# EAGLE design adc_guarded_newinput_nobnc (EAGLE 5.07)
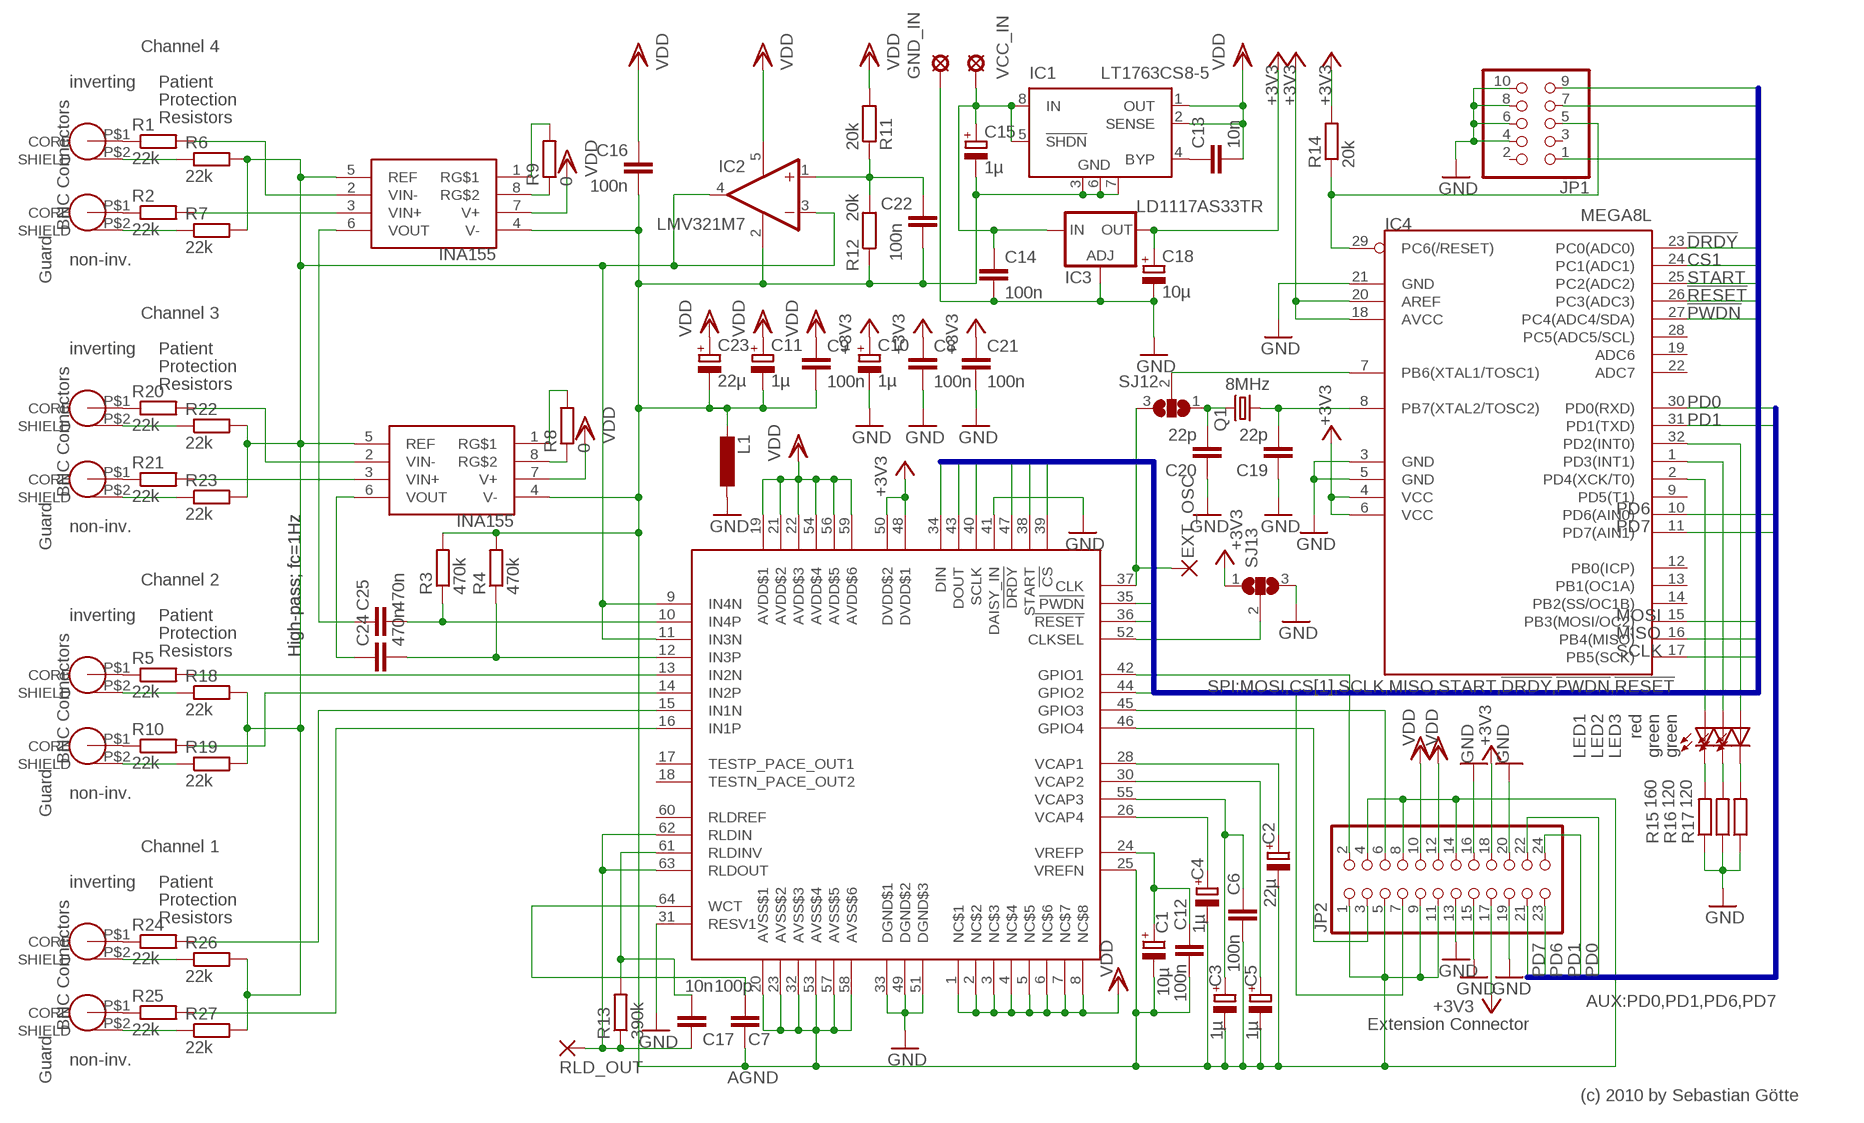
[diagram p0: schematic, sheet 1]

## Parts
C1  10µ  CPOL-EUSMCC  [SMC_C]
C2  22µ  CPOL-EUSMCD  [SMC_D]
C3  1µ  CPOL-EUSMCA  [SMC_A]
C4  1µ  CPOL-EUSMCA  [SMC_A]
C5  1µ  CPOL-EUSMCA  [SMC_A]
C6  100n  C-EUC1206  [C1206]
C7  100p  C-EUC1206  [C1206]
C8  100n  C-EUC1206  [C1206]
C9  100n  C-EUC1206  [C1206]
C10  1µ  CPOL-EUSMCA  [SMC_A]
C11  1µ  CPOL-EUSMCA  [SMC_A]
C12  100n  C-EUC1206  [C1206]
C13  10n  C-EUC1206  [C1206]
C14  100n  C-EUC1206  [C1206]
C15  1µ  CPOL-EUSMCA  [SMC_A]
C16  100n  C-EUC1206  [C1206]
C17  10n  C-EUC1206  [C1206]
C18  10µ  CPOL-EUSMCC  [SMC_C]
C19  22p  C-EUC1206  [C1206]
C20  22p  C-EUC1206  [C1206]
C21  100n  C-EUC1206  [C1206]
C22  100n  C-EUC1206  [C1206]
C23  22µ  CPOL-EUSMCD  [SMC_D]
C24  470n  C-EUC1206  [C1206]
C25  470n  C-EUC1206  [C1206]
EXT_OSC  1,6/0,8  [1,6/0,8]
GND_IN  MCS10B  [MCS10B]
IC1  LT1763CS8-5  LT1763CS8-3.3  [SOIC8]
IC2  LMV321M7  [SC70-5L]
IC3  LD1117AS33TR  LD117AS33TR  [SOT223]
IC4  MEGA8L  MEGA8-AI  [TQFP32-08]
JP1  PINHD-2X5  [2X05]
JP2  PINHD-2X12  [2X12]
L1  L-EUPIS2816  [PIS2816]
LED1  red  LEDCHIPLED_1206  [CHIPLED_1206]
LED2  green  LEDCHIPLED_1206  [CHIPLED_1206]
LED3  green  LEDCHIPLED_1206  [CHIPLED_1206]
Q1  8MHz  CRYSTALHC49UP  [HC49UP]
R1  22k  R-EU_R1206  [R1206]
R2  22k  R-EU_R1206  [R1206]
R3  470k  R-EU_R1206  [R1206]
R4  470k  R-EU_R1206  [R1206]
R5  22k  R-EU_R1206  [R1206]
R6  22k  R-EU_R1206  [R1206]
R7  22k  R-EU_R1206  [R1206]
R8  0  R-EU_R1206  [R1206]
R9  0  R-EU_R1206  [R1206]
R10  22k  R-EU_R1206  [R1206]
R11  20k  R-EU_R1206  [R1206]
R12  20k  R-EU_R1206  [R1206]
R13  390k  R-EU_R1206  [R1206]
R14  20k  R-EU_R1206  [R1206]
R15  160  R-EU_R1206  [R1206]
R16  120  R-EU_R1206  [R1206]
R17  120  R-EU_R1206  [R1206]
R18  22k  R-EU_R1206  [R1206]
R19  22k  R-EU_R1206  [R1206]
R20  22k  R-EU_R1206  [R1206]
R21  22k  R-EU_R1206  [R1206]
R22  22k  R-EU_R1206  [R1206]
R23  22k  R-EU_R1206  [R1206]
R24  22k  R-EU_R1206  [R1206]
R25  22k  R-EU_R1206  [R1206]
R26  22k  R-EU_R1206  [R1206]
R27  22k  R-EU_R1206  [R1206]
RLD_OUT  2,54/1,0  [2,54/1,0]
SJ12  SJ2W  [SJ_2]
SJ13  SJ2W  [SJ_2]
U$1  ADS1194  [TQFP-64]
U$2  INA155  [SO-08]
U$3  INA155  [SO-08]
U$4  RG174_THTTHROUGH-HOLE  [RG174_THT]
U$5  RG174_THTTHROUGH-HOLE  [RG174_THT]
U$6  RG174_THTTHROUGH-HOLE  [RG174_THT]
U$7  RG174_THTTHROUGH-HOLE  [RG174_THT]
U$8  RG174_THTTHROUGH-HOLE  [RG174_THT]
U$9  RG174_THTTHROUGH-HOLE  [RG174_THT]
U$10  RG174_THTTHROUGH-HOLE  [RG174_THT]
U$11  RG174_THTTHROUGH-HOLE  [RG174_THT]
VCC_IN  MCS10B  [MCS10B]

## Nets
!DRDY: IC4.23(PC0(ADC0)) U$1.47(!DRDY)
!PWDN: IC4.27(PC4(ADC4/SDA)) U$1.35(!PWDN)
!RESET: IC4.26(PC3(ADC3)) U$1.36(!RESET)
+3V3: C8.1 C10.+ C18.+ C21.1 IC3.4(OUT) IC4.4(VCC) IC4.6(VCC) IC4.18(AVCC) IC4.20(AREF) JP2.17 JP2.18 R14.2 SJ13.1 U$1.48(DVDD$1) U$1.50(DVDD$2)
ADS1194_GPIO1: JP2.2 U$1.42(GPIO1)
ADS1194_GPIO2: JP2.7 U$1.44(GPIO2)
ADS1194_GPIO3: JP2.6 U$1.45(GPIO3)
ADS1194_GPIO4: JP2.3 U$1.46(GPIO4)
AGND: C1.- C2.- C3.- C4.- C5.- C6.2 C7.1 C9.2 C11.- C12.2 C15.- C16.2 C22.2 C23.- IC1.3(GND) IC1.6(GND) IC1.7(GND) IC2.2(V-) JP2.1 JP2.4 JP2.5 JP2.8 JP2.9 JP2.11 JP2.14 L1.2 R3.2 R4.2 R12.1 U$1.20(AVSS$1) U$1.23(AVSS$2) U$1.25(VREFN) U$1.32(AVSS$3) U$1.53(AVSS$4) U$1.57(AVSS$5) U$1.58(AVSS$6) U$2.4(V-) U$3.4(V-)
CLK: EXT_OSC.1(P) SJ12.3 U$1.37(CLK)
CLKSEL: SJ13.2 U$1.52(CLKSEL)
CS1: IC4.24(PC1(ADC1)) U$1.39(!CS)
GND: C8.2 C10.- C14.2 C18.- C19.1 C20.1 C21.2 GND_IN.MP IC3.1(ADJ) IC4.3(GND) IC4.5(GND) IC4.21(GND) JP1.4 JP1.6 JP1.8 JP1.10 JP2.13 JP2.15 JP2.16 JP2.19 JP2.20 L1.1 R15.1 R16.1 R17.1 SJ13.3 U$1.31(RESV1) U$1.33(DGND$1) U$1.41(DAISY_IN) U$1.49(DGND$2) U$1.51(DGND$3)
MISO: IC4.16(PB4(MISO)) JP1.9 U$1.43(DOUT)
MOSI: IC4.15(PB3(MOSI/OC2)) JP1.1 U$1.34(DIN)
N$1: C2.+ U$1.28(VCAP1)
N$2: C4.+ U$1.26(VCAP4)
N$3: C7.2 U$1.64(WCT)
N$4: C5.+ U$1.30(VCAP2)
N$5: C3.+ C6.1 U$1.55(VCAP3)
N$6: C1.+ C12.1 U$1.24(VREFP)
N$7: R9.1 U$2.8(RG$2)
N$9: C25.2 R3.1 U$1.10(IN4P)
N$11: R5.2 U$1.13(IN2N)
N$12: R2.2 U$2.3(VIN+)
N$13: R1.2 U$2.2(VIN-)
N$14: R1.1 U$4.P$1(CORE)
N$15: R2.1 U$5.P$1(CORE)
N$16: C13.1 IC1.4(BYP)
N$17: R20.1 U$6.P$1(CORE)
N$18: R21.1 U$7.P$1(CORE)
N$19: R9.2 U$2.1(RG$1)
N$20: C25.1 U$2.6(VOUT)
N$21: R19.1 U$10.P$2(SHIELD)
N$22: R18.1 U$11.P$2(SHIELD)
N$23: R5.1 U$11.P$1(CORE)
N$24: R10.2 U$1.14(IN2P)
N$25: R8.2 U$3.1(RG$1)
N$26: C24.1 U$3.6(VOUT)
N$27: R10.1 U$10.P$1(CORE)
N$28: R20.2 U$3.2(VIN-)
N$29: R21.2 U$3.3(VIN+)
N$30: R7.1 U$5.P$2(SHIELD)
N$31: R6.1 U$4.P$2(SHIELD)
N$32: C24.2 R4.1 U$1.12(IN3P)
N$33: R8.1 U$3.8(RG$2)
N$34: C17.2 R13.2 U$1.61(RLDINV)
N$35: C20.2 Q1.2 SJ12.1
N$36: R24.2 U$1.15(IN1N)
N$37: R25.2 U$1.16(IN1P)
N$38: C19.2 IC4.8(PB7(XTAL2/TOSC2)) Q1.1
N$40: IC4.7(PB6(XTAL1/TOSC1)) SJ12.2
N$41: IC4.32(PD2(INT0)) LED3.A
N$42: IC4.1(PD3(INT1)) LED2.A
N$43: IC4.2(PD4(XCK/T0)) LED1.A
N$44: LED1.C R15.2
N$45: LED2.C R16.2
N$46: LED3.C R17.2
N$47: R24.1 U$9.P$1(CORE)
N$48: IC2.3(-IN) IC2.4(OUT) R6.2 R7.2 R18.2 R19.2 R22.2 R23.2 R26.2 R27.2 U$1.9(IN4N) U$1.11(IN3N) U$2.5(REF) U$3.5(REF)
N$49: R25.1 U$8.P$1(CORE)
N$58: R23.1 U$7.P$2(SHIELD)
N$59: R22.1 U$6.P$2(SHIELD)
N$65: R27.1 U$8.P$2(SHIELD)
N$66: R26.1 U$9.P$2(SHIELD)
PD0: IC4.30(PD0(RXD)) JP2.22
PD1: IC4.31(PD1(TXD)) JP2.24
PD6: IC4.10(PD6(AIN0)) JP2.23
PD7: IC4.11(PD7(AIN1)) JP2.21
REF_NODE: C22.1 IC2.1(+IN) R11.1 R12.2
RLD_OUT: C17.1 R13.1 RLD_OUT.1(P) U$1.62(RLDIN) U$1.63(RLDOUT)
SCLK: IC4.17(PB5(SCK)) JP1.7 U$1.40(SCLK)
START: IC4.25(PC2(ADC2)) U$1.38(START)
UCRESET: IC4.29(PC6(/RESET)) JP1.5 R14.1
VCC_IN: C14.1 C15.+ IC1.5(!SHDN) IC1.8(IN) IC3.3(IN) VCC_IN.MP
VDD: C9.1 C11.+ C13.2 C16.1 C23.+ IC1.1(OUT) IC1.2(SENSE) IC2.5(V+) JP2.10 JP2.12 R11.2 U$1.1(NC$1) U$1.2(NC$2) U$1.3(NC$3) U$1.4(NC$4) U$1.5(NC$5) U$1.6(NC$6) U$1.7(NC$7) U$1.8(NC$8) U$1.19(AVDD$1) U$1.21(AVDD$2) U$1.22(AVDD$3) U$1.54(AVDD$4) U$1.56(AVDD$5) U$1.59(AVDD$6) U$2.7(V+) U$3.7(V+)
Unconnected: IC4.9(PD5(T1)) IC4.12(PB0(ICP)) IC4.13(PB1(OC1A)) IC4.14(PB2(SS/OC1B)) IC4.19(ADC6) IC4.22(ADC7) IC4.28(PC5(ADC5/SCL)) JP1.2 JP1.3 U$1.17(TESTP_PACE_OUT1) U$1.18(TESTN_PACE_OUT2) U$1.60(RLDREF)

## Buses
SPI:MOSI,CS[1],SCLK,MISO,START,!DRDY,!PWDN,!RESET
AUX:PD0,PD1,PD6,PD7

## Notes on the sheet
- Channel 4
- inverting | Patient
- Protection
- Resistors
- BNC Connectors
- INA155
- non-inv.
- Guard
- Channel 3
- inverting | Patient
- Protection
- Resistors
- BNC Connectors
- INA155
- non-inv.
- Guard
- Channel 2
- inverting | Patient
- Protection
- Resistors | High-pass; fc=1Hz | High-pass; fc=1Hz
- BNC Connectors
- non-inv.
- Guard
- Channel 1
- inverting | Patient
- Protection
- Resistors
- BNC Connectors | Extension Connector
- non-inv.
- Guard | AGND
- (c) 2010 by Sebastian Götte

## Library data of the parts
C1-C5 C10 C11 C15 C18 C23 = rcl:CPOL-EU: POLARIZED CAPACITOR, European symbol
C6-C9 C12-C14 C16 C17 C19-C22 C24 C25 = rcl:C-EU: CAPACITOR, European symbol
EXT_OSC = wirepad:1,6/0,8: THROUGH-HOLE PAD
GND_IN VCC_IN = solpad:MCS10B: SOLDER PAD MC S1, distributor Buerklin, 15F505
IC1 = linear-technology:LT1763CS8: 500mA, Low Noise, LDO Micropower Regulators Source: http://cds.linear.com/docs/Datasheet/1763ff.pdf
IC2 = linear:LMV321?*: General Purpose, Low Voltage, Rail-to-Rail Output Operational Amplifiers Source: http://www.national.com/mpf/LM/LMV321.html http://www.national.com/dt/lmv_qual.pdf
IC3 = v-reg:LD117A?*: Low drop fixed and adjustable positive voltage regulators 1 A Source: http://www.st.com/stonline/products/literature/ds/7194/ld1117axx.pdf
IC4 = atmel:MEGA8: MICROCONTROLLER 8 Kbytes FLASH, 1 kbytes SRAM, 512 bytes EEPROM, USART, 6-channel 10 bit ADC, 2-channel 8 bit ADC Pin compatible with Atmega48, ATMega88, ATMega168 Source: avr.lbr
JP1 = pinhead:PINHD-2X5: PIN HEADER
JP2 = pinhead:PINHD-2X12: PIN HEADER
L1 = rcl:L-EU: INDUCTOR, European symbol
LED1-LED3 = led:LED: LED OSRAM: - CHIPLED LG R971, LG N971, LY N971, LG Q971, LY Q971, LO R971, LY R971 LH N974, LH R974 LS Q976, LO Q976, LY Q976 LO Q996 - Hyper CHIPLED LW Q18S LB Q993, LB Q99A, LB R99A - SideLED LS A670, LO A670, LY A670, LG A670, LP A670 LB A673, LV A673, LT A673, LW A673 LH A674 LY A675 LS A676, LA A676, LO A676, LY A676, LW A676 LS A679, LY A679, LG A679 - Hyper Micro SIDELED® LS Y876, LA Y876, LO Y876, LY Y876 LT Y87S - SmartLED LW L88C, LW L88S LB L89C, LB L89S, LG L890 LS L89K, LO L89K, LY L89K LS L896, LA L896, LO L896, LY L896 - TOPLED LS T670, LO T670, LY T670, LG T670, LP T670 LSG T670, LSP T670, LSY T670, LOP T670, LYG T670 LG T671, LOG T671, LSG T671 LB T673, LV T673, LT T673, LW T673 LH T674 LS T676, LA T676, LO T676, LY T676, LB T676, LH T676, LSB T676, LW T676 LB T67C, LV T67C, LT T67C, LS T67K, LO T67K, LY T67K, LW E67C LS E67B, LA E67B, LO E67B, LY E67B, LB E67C, LV E67C, LT E67C LW T67C LS T679, LY T679, LG T679 LS T770, LO T770, LY T770, LG T770, LP T770 LB T773, LV T773, LT T773, LW T773 LH T774 LS E675, LA E675, LY E675, LS T675 LS T776, LA T776, LO T776, LY T776, LB T776 LHGB T686 LT T68C, LB T68C - Hyper Mini TOPLED® LB M676 - Mini TOPLED Santana® LG M470 LS M47K, LO M47K, LY M47K Source: http://www.osram.convergy.de LUXEON: - LUMILED® LXK2-PW12-R00, LXK2-PW12-S00, LXK2-PW14-U00, LXK2-PW14-V00 LXK2-PM12-R00, LXK2-PM12-S00, LXK2-PM14-U00 LXK2-PE12-Q00, LXK2-PE12-R00, LXK2-PE12-S00, LXK2-PE14-T00, LXK2-PE14-U00 LXK2-PB12-K00, LXK2-PB12-L00, LXK2-PB12-M00, LXK2-PB14-N00, LXK2-PB14-P00, LXK2-PB14-Q00 LXK2-PR12-L00, LXK2-PR12-M00, LXK2-PR14-Q00, LXK2-PR14-R00 LXK2-PD12-Q00, LXK2-PD12-R00, LXK2-PD12-S00 LXK2-PH12-R00, LXK2-PH12-S00 LXK2-PL12-P00, LXK2-PL12-Q00, LXK2-PL12-R00 Source: www.luxeon.com KINGBRIGHT: KA-3528ASYC Source: www.kingbright.com
Q1 = crystal:CRYSTAL: CRYSTAL
R1-R27 = rcl:R-EU_: RESISTOR, European symbol
RLD_OUT = wirepad:2,54/1,0: THROUGH-HOLE PAD
SJ12 SJ13 = jumper:SJ2W: SMD solder JUMPER
U$1 = mytexas:ADS1194: Low-Power, 8-Channel, 16-Bit Analog Front-End for Biopotential Measurements for ECG/EEG applications
U$2 U$3 = mytexas:INA155: Single-Supply, Rail-to-Rail Output, CMOS INSTRUMENTATION AMPLIFIER
U$4-U$11 = myparts:RG174_THT

## Board
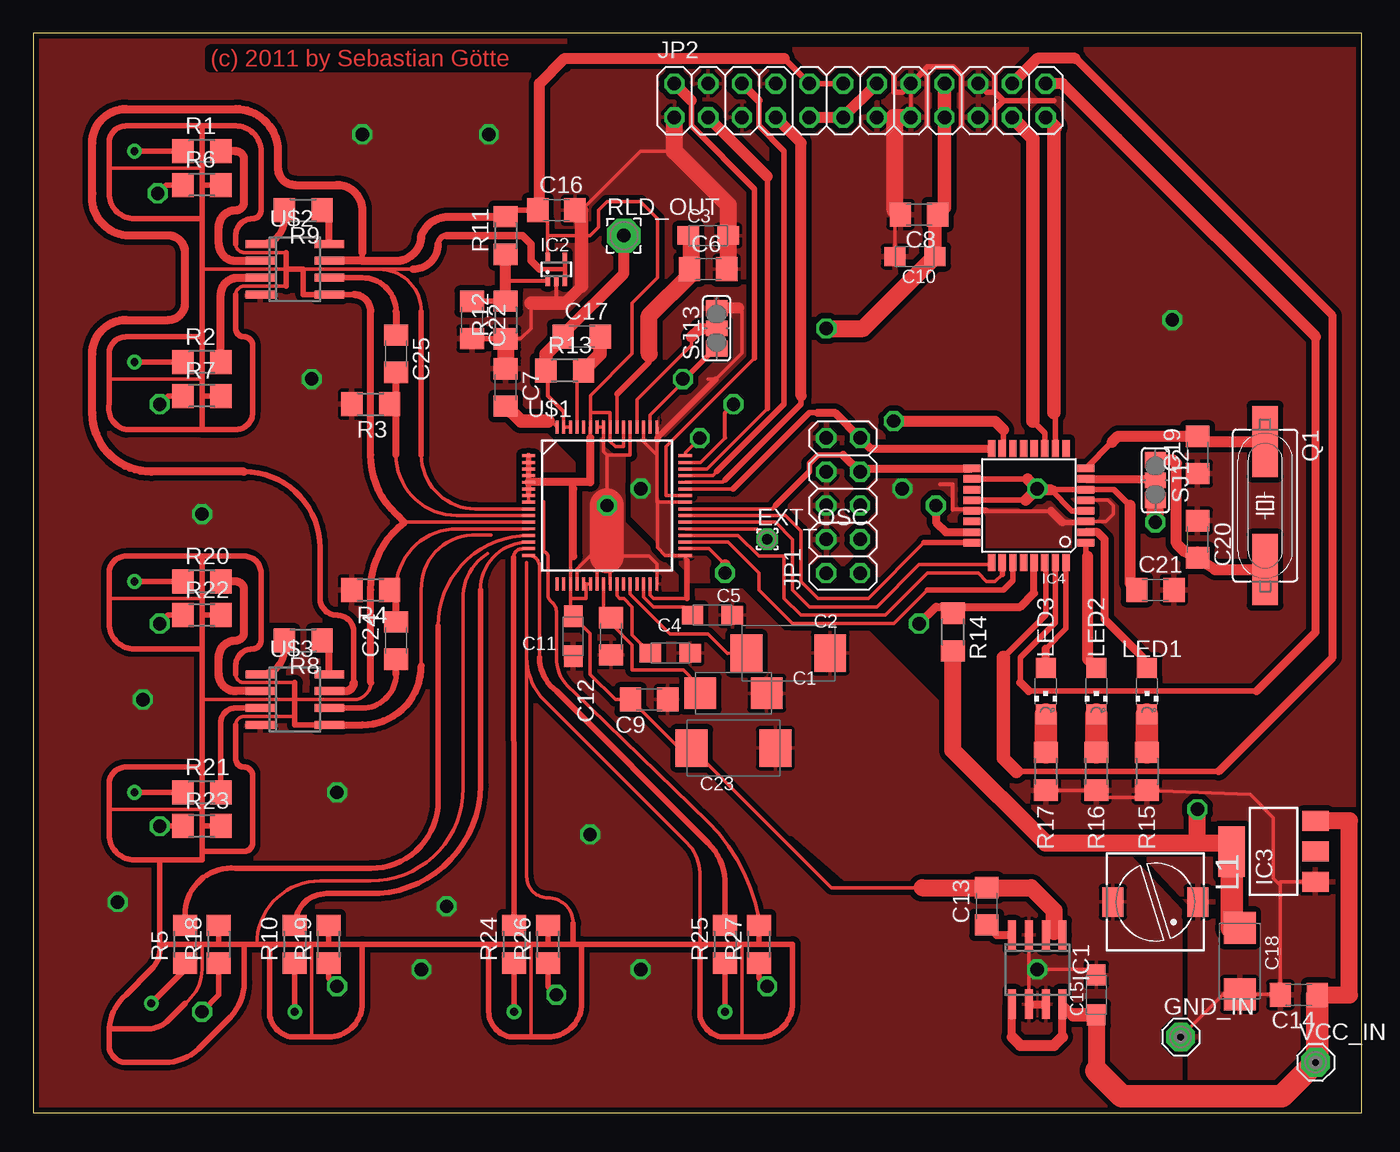
[diagram p1: board, top side]
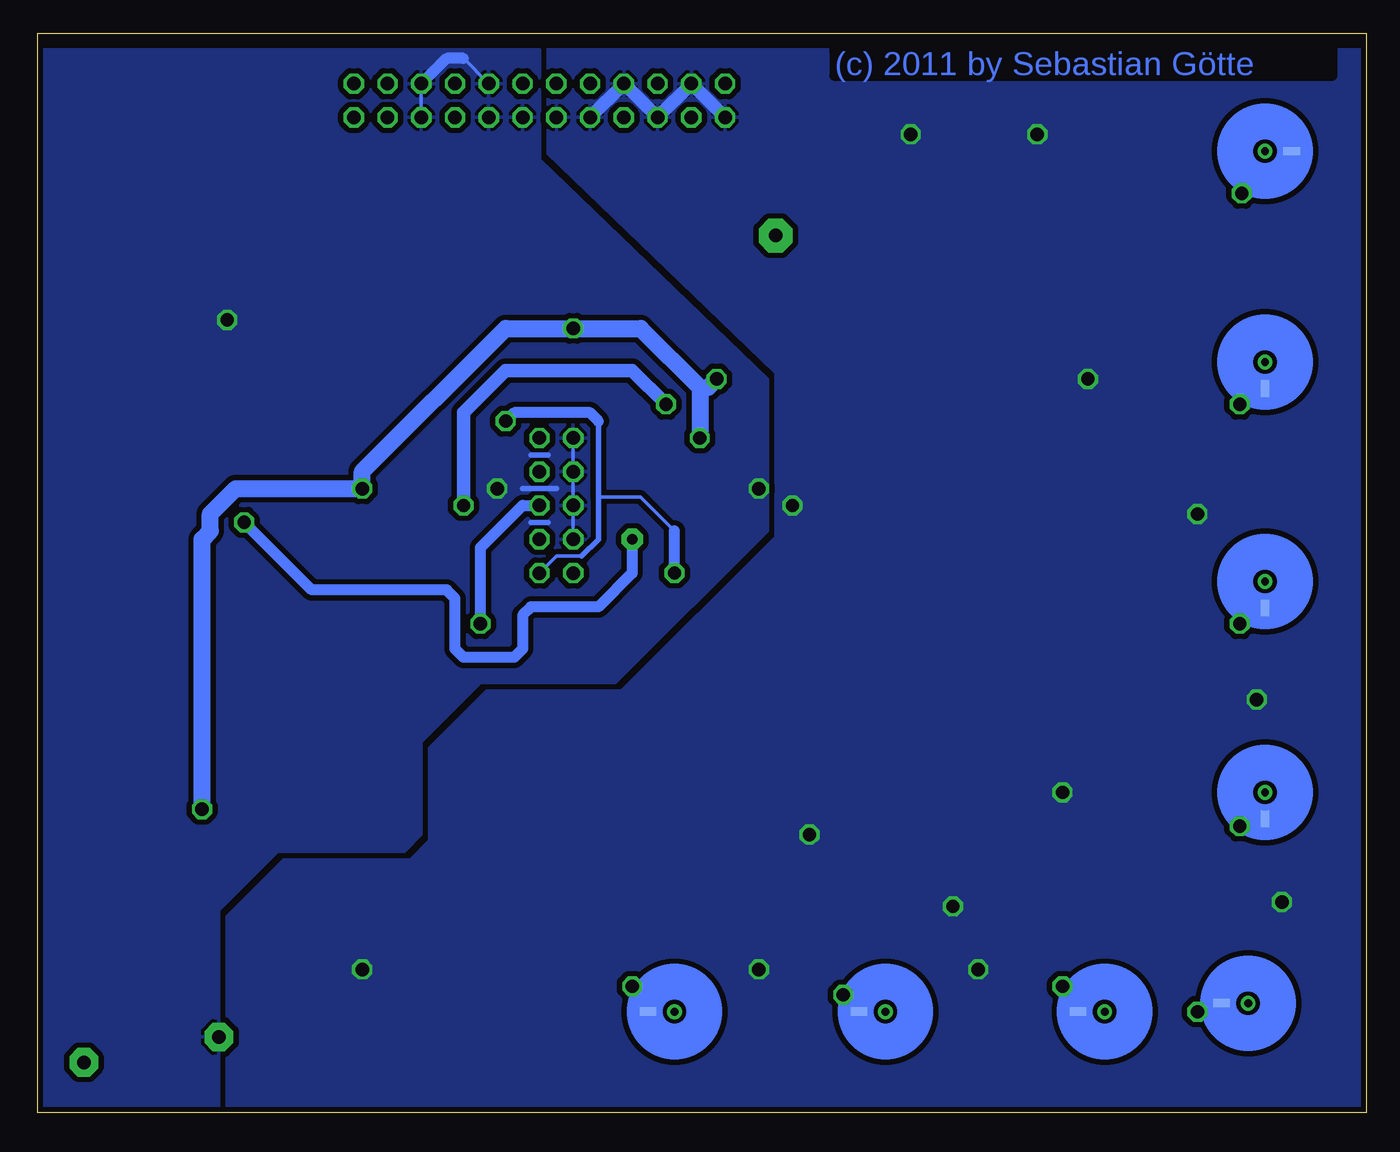
[diagram p2: board, bottom side, seen from below]

Size 100 x 81.27 mm. Coordinates in mm from the lower left corner, seen from the top.
Outline: 0,0 100,0 100,81.27 0,81.27 0,0
Copper layers (1*16): Top 0.035mm / dielectric 1.5mm / Bottom 0.035mm
Design rules "Fusion_eagle_rule_v1.1": minimum track width 6mil, minimum drill 12mil, track to track 6mil, track to pad 6mil, pad to pad 6mil, via to via 6mil, smd to smd 0mil, copper to edge 10mil, drill to drill 10mil, minimum pad ring 10mil, minimum via ring 6mil, stop-mask expansion 2mil, vias tented up to drill 100mil, thermal gap 10mil

### Footprints (pad centres in the part's own frame; a part is rotated, then mirrored left to right if it is on the bottom)
SMC_C = smd 2.4 x 2.4: + -2.5,0; - 2.5,0
SMC_D = smd 2.4 x 2.8: + -3.15,0; - 3.15,0
SMC_A = smd 1.6 x 1.4: + -1.5,0; - 1.5,0
C1206 = smd 1.6 x 1.8: 1 -1.4,0; 2 1.4,0
1,6/0,8 = drill 0.813 pad 1.6 octagon: 1 0,0
MCS10B = drill 1.016 pad 2.159 octagon: MP 0,0
SOIC8 = smd 0.6 x 2.2: 1 -1.905,-2.6; 2 -0.635,-2.6; 3 0.635,-2.6; 4 1.905,-2.6; 5 1.905,2.6; 6 0.635,2.6; 7 -0.635,2.6; 8 -1.905,2.6
SC70-5L = smd 0.35 x 0.8: 1 -0.65,-0.85; 2 0,-0.85; 3 0.65,-0.85; 4 0.65,0.85; 5 -0.65,0.85
SOT223 = smd 1.5 x 2: 1 -2.3,-3.15; 2 0,-3.15; 3 2.3,-3.15 | smd 3.8 x 2: 4 0,3.15
TQFP32-08 = smd 1.27 x 0.559: 1 -4.293,2.8; 2 -4.293,2; 3 -4.293,1.2; 4 -4.293,0.4; 5 -4.293,-0.4; 6 -4.293,-1.2; 7 -4.293,-2; 8 -4.293,-2.8; 17 4.293,-2.8; 18 4.293,-2; 19 4.293,-1.2; 20 4.293,-0.4; 21 4.293,0.4; 22 4.293,1.2; 23 4.293,2; 24 4.293,2.8 | smd 0.559 x 1.27: 9 -2.8,-4.293; 10 -2,-4.293; 11 -1.2,-4.293; 12 -0.4,-4.293; 13 0.4,-4.293; 14 1.2,-4.293; 15 2,-4.293; 16 2.8,-4.293; 25 2.8,4.293; 26 2,4.293; 27 1.2,4.293; 28 0.4,4.293; 29 -0.4,4.293; 30 -1.2,4.293; 31 -2,4.293; 32 -2.8,4.293
2X05 = drill 1.016 octagon: 1 -5.08,-1.27; 2 -5.08,1.27; 3 -2.54,-1.27; 4 -2.54,1.27; 5 0,-1.27; 6 0,1.27; 7 2.54,-1.27; 8 2.54,1.27; 9 5.08,-1.27; 10 5.08,1.27
2X12 = drill 1.016 octagon: 1 -13.97,-1.27; 2 -13.97,1.27; 3 -11.43,-1.27; 4 -11.43,1.27; 5 -8.89,-1.27; 6 -8.89,1.27; 7 -6.35,-1.27; 8 -6.35,1.27; 9 -3.81,-1.27; 10 -3.81,1.27; 11 -1.27,-1.27; 12 -1.27,1.27; 13 1.27,-1.27; 14 1.27,1.27; 15 3.81,-1.27; 16 3.81,1.27; 17 6.35,-1.27; 18 6.35,1.27; 19 8.89,-1.27; 20 8.89,1.27; 21 11.43,-1.27; 22 11.43,1.27; 23 13.97,-1.27; 24 13.97,1.27
PIS2816 = smd 2.2 x 1.6: 1 0,3.2; 2 0,-3.2
CHIPLED_1206 = smd 1.5 x 1.5: A 0,-1.75; C 0,1.75
HC49UP = smd 5.334 x 1.93: 1 -4.826,0; 2 4.826,0
R1206 = smd 1.6 x 1.803: 1 -1.422,0; 2 1.422,0
2,54/1,0 = drill 1.016 pad 2.54 octagon: 1 0,0
SJ_2 = smd 1.168 x 1.6: 1 -1.524,0; 2 0,0; 3 1.524,0
TQFP-64 = smd 1 x 0.22: 1 -5.9,3.75; 2 -5.9,3.25; 3 -5.9,2.75; 4 -5.9,2.25; 5 -5.9,1.75; 6 -5.9,1.25; 7 -5.9,0.75; 8 -5.9,0.25; 9 -5.9,-0.25; 10 -5.9,-0.75; 11 -5.9,-1.25; 12 -5.9,-1.75; 13 -5.9,-2.25; 14 -5.9,-2.75; 15 -5.9,-3.25; 16 -5.9,-3.75; 33 5.9,-3.75; 34 5.9,-3.25; 35 5.9,-2.75; 36 5.9,-2.25; 37 5.9,-1.75; 38 5.9,-1.25; 39 5.9,-0.75; 40 5.9,-0.25; 41 5.9,0.25; 42 5.9,0.75; 43 5.9,1.25; 44 5.9,1.75; 45 5.9,2.25; 46 5.9,2.75; 47 5.9,3.25; 48 5.9,3.75 | smd 0.22 x 1: 17 -3.75,-5.9; 18 -3.25,-5.9; 19 -2.75,-5.9; 20 -2.25,-5.9; 21 -1.75,-5.9; 22 -1.25,-5.9; 23 -0.75,-5.9; 24 -0.25,-5.9; 25 0.25,-5.9; 26 0.75,-5.9; 27 1.25,-5.9; 28 1.75,-5.9; 29 2.25,-5.9; 30 2.75,-5.9; 31 3.25,-5.9; 32 3.75,-5.9; 49 3.75,5.9; 50 3.25,5.9; 51 2.75,5.9; 52 2.25,5.9; 53 1.75,5.9; 54 1.25,5.9; 55 0.75,5.9; 56 0.25,5.9; 57 -0.25,5.9; 58 -0.75,5.9; 59 -1.25,5.9; 60 -1.75,5.9; 61 -2.25,5.9; 62 -2.75,5.9; 63 -3.25,5.9; 64 -3.75,5.9
SO-08 = smd 0.6 x 2.2: 1 -1.905,-2.6; 2 -0.635,-2.6; 3 0.635,-2.6; 4 1.905,-2.6; 5 1.905,2.6; 6 0.635,2.6; 7 -0.635,2.6; 8 -1.905,2.6
RG174_THT = drill 0.6 round: P$1 0,0 | smd 1.27 x 0.635: P$2 2,0

### Placement (x,y rotation side)
C1  52.71,31.59 0 top
C2  56.83,34.61 0 top
C3  50.8,66.04 0 top
C4  47.94,34.61 0 top
C5  51.12,37.47 0 top
C6  50.8,63.5 0 top
C7  35.56,54.61 270 top
C8  66.67,67.63 180 top
C9  46.35,31.11 0 top
C10  66.36,64.45 180 top
C11  40.64,35.88 270 top
C12  43.5,35.88 270 top
C13  71.75,15.56 90 top
C14  95.25,8.89 180 top
C15  80.01,8.89 90 top
C16  39.37,67.94 0 top
C17  41.27,58.42 0 top
C18  90.81,11.43 270 top
C19  87.63,49.53 90 top
C20  87.63,43.18 270 top
C21  84.45,39.37 0 top
C22  33.02,59.69 270 top
C23  52.7,27.46 0 top
C24  27.3,35.56 90 top
C25  27.3,57.15 270 top
EXT_OSC  55.24,43.18 0 top
GND_IN  86.36,5.71 0 top
IC1  75.56,10.79 180 top
IC2  39.37,63.5 0 top
IC3  93.34,19.68 90 top
IC4  74.93,45.72 180 top
JP1  60.96,45.72 90 top
JP2  62.23,76.2 0 top
L1  84.45,15.88 270 top
LED1  83.82,31.75 180 top
LED2  80.01,31.75 180 top
LED3  76.2,31.75 180 top
Q1  92.71,45.72 270 top
R1  12.7,72.39 0 top
R2  12.7,56.52 0 top
R3  25.4,53.34 180 top
R4  25.4,39.37 180 top
R5  11.43,12.7 90 top
R6  12.7,69.85 0 top
R7  12.7,53.98 0 top
R8  20.32,35.56 180 top
R9  20.32,67.94 180 top
R10  19.68,12.7 90 top
R11  35.56,66.04 90 top
R12  35.56,59.69 90 top
R13  40.01,55.88 0 top
R14  69.22,36.2 270 top
R15  83.82,25.72 90 top
R16  80.01,25.72 90 top
R17  76.2,25.72 90 top
R18  13.97,12.7 90 top
R19  22.23,12.7 90 top
R20  12.7,40.01 0 top
R21  12.7,24.13 0 top
R22  12.7,37.47 0 top
R23  12.7,21.59 0 top
R24  36.2,12.7 90 top
R25  52.07,12.7 90 top
R26  38.73,12.7 90 top
R27  54.61,12.7 90 top
RLD_OUT  44.45,66.04 0 top
SJ12  84.45,47.62 270 top
SJ13  51.44,59.05 90 top
U$1  43.18,45.72 0 top
U$2  19.68,63.5 270 top
U$3  19.68,31.11 270 top
U$4  7.62,72.39 0 bottom
U$5  7.62,56.52 270 bottom
U$6  7.62,40.01 270 bottom
U$7  7.62,24.13 270 bottom
U$8  52.07,7.62 180 bottom
U$9  36.2,7.62 180 bottom
U$10  19.68,7.62 180 bottom
U$11  8.89,8.26 180 bottom
VCC_IN  96.52,3.81 0 top

### Tracks (layer width: path | path; a pad name or v marks a point on that pad's centre or on a via)
!DRDY  (via drill 1)
  Top 0.254: U$1.47 50.24,48.97 52.07,50.8
  Top 0.305: 52.07,50.8 52.07,52.7 v52.7,53.34
  Top 0.61: v67.94,45.72 67.94,44.45 68.67,43.72 IC4.23
  Bottom 1.016: v52.7,53.34 55.24,55.88 64.77,55.88 67.94,52.7 v67.94,45.72
!PWDN
  Top 0.254: U$1.35 52.28,42.97 54.61,40.64 54.61,39.37 57.15,36.83 64.77,36.83 67.31,39.37
  Top 0.406: 67.31,39.37 73.03,39.37 73.73,40.08 IC4.27
!RESET
  Top 0.254: U$1.36 53.05,43.47 54.61,41.91 56.52,41.91 56.52,38.73 57.78,37.47 64.14,37.47 67.31,40.64 71.12,40.64 71.75,40.01 72.39,40.01 72.93,40.55
  Top 0.406: 72.93,40.55 IC4.26
+3V3  (via drill 1)
  Top 0.254: 67.86,67.41 C8.1 68.58,68.13 | v75.56,46.99 75.64,46.92 | 89.56,20.32 IC3.4 | U$1.50 46.43,52.53 SJ13.1 51.18,57.53 v48.9,55.24 | U$1.48 49.08,49.72 v50.16,50.8 | 82.55,39.88 C21.1
  Top 0.406: 76.83,46.92 IC4.6 81.35,46.92 82.55,45.72 | 78.44,45.32 IC4.4 78.19,45.32 76.59,46.92 | 74.83,47.72 IC4.18 | 74.69,46.12 IC4.20
  Top 0.61: 76.52,46.92 76.83,46.92
  Top 0.813: 75.64,46.92 76.52,46.92 76.59,46.92 | 74.83,47.72 v75.56,46.99 74.69,46.12 | 82.55,45.72 82.55,39.88
  Top 1.016: C10.+ 67.86,67.41 | 68.58,68.13 JP2.17 JP2.18
  Top 1.27: 87.63,20.32 76.2,20.32 69.22,27.3 R14.2 | 87.63,20.32 89.56,20.32 | v59.69,59.05 62.46,59.05 C10.+ | 87.63,20.32 v87.63,22.86
  Top 1.676: C18.+ 90.19,13.93 IC3.4
  Bottom 0.254: 50.16,54.61 49.53,54.61
  Bottom 1.27: v50.16,50.8 50.16,54.61 54.61,59.05 v59.69,59.05 64.77,59.05 75.56,48.26 v75.56,46.99 85.09,46.99 87,45.09 87,43.81 87.63,43.18 v87.63,22.86 | 49.53,54.61 v48.9,55.24
ADS1194_GPIO1
  Top 0.254: U$1.42 47.62,46.47 47.62,50.16 54.29,56.83
  Top 0.406: 49.53,76.2 49.53,74.3 54.29,69.53 54.29,56.83
  Top 0.813: 49.53,76.2 JP2.2
ADS1194_GPIO2
  Top 0.254: 52.07,47.62 51.91,47.47 U$1.44
  Top 0.406: 57.78,53.98 57.78,53.34 52.07,47.62
  Top 0.813: JP2.7 57.78,73.03 57.78,53.98
ADS1194_GPIO3
  Top 0.254: U$1.45 51.15,47.97 51.44,48.26
  Top 0.406: 51.44,48.26 56.52,53.34 56.52,72.39 54.61,74.3 54.61,76.2
  Top 0.61: 54.61,76.2 JP2.6
ADS1194_GPIO4
  Top 0.254: U$1.46 50.69,48.47 55.24,53.02
  Top 0.406: 55.24,53.02 55.24,70.48
  Top 0.813: 55.24,70.48 JP2.3
AGND  (via drill 1)
  Top 0.254: U$1.20 40.93,40.93 41.91,41.91 42.43,41.39 | U$1.23 42.43,41.39 | 42.43,41.39 42.95,41.91 43.18,41.91 43.43,41.66 U$1.25 43.43,41.52 43.81,41.91 46.35,41.91 46.93,41.34 U$1.32 | 43.18,49.53 42.93,49.78 U$1.57 U$1.58 | v43.18,45.72 43.18,49.53 | IC1.6 74.93,10.79 | 74.93,10.79 IC1.3 | C15.- 79.61,10.79 v75.56,10.79 74.93,10.79 | 48.26,72.39 45.72,72.39 41.27,67.94 | R12.1 36.68,58.27 37.47,59.05 37.47,60.96 | U$1.53 44.93,49.53 43.18,49.53
  Top 0.305: 39.37,60.96 IC2.2
  Top 0.406: R12.1 33.04,58.27 C22.2
  Top 0.61: IC1.6 IC1.7
  Top 0.813: 40.01,60.96 41.27,62.23 | JP2.9 JP2.11 JP2.14
  Top 1.016: 41.27,62.23 41.27,67.94 | 37.47,60.96 39.37,60.96 40.01,60.96
  Top 1.27: C6.2 52.3,64.05 C3.- 52.3,68.35 48.26,72.39 JP2.1 | R12.1 C7.1
  Top 2.54: 43.18,41.91 v43.18,45.72
  Bottom 1.016: JP2.1 JP2.4 JP2.5 JP2.8 JP2.9
  other vias: 20.95,55.24 41.91,20.95 31.11,15.56 22.86,24.13 34.29,73.66 24.77,73.66 12.7,45.09 8.26,31.11 6.35,15.88 29.21,10.79 45.72,10.79
  pour Top (isolate 0.406): 0,81.28 40.01,81.28 40.01,79.38 38.1,77.47 38.1,51.44 40.64,48.9 40.64,29.84 47.62,22.86 55.88,22.86 61.59,17.14 61.59,0 16.51,0 0,0 0,64.77
  pour Bottom (isolate 0.406, rank 2): 62.23,80.01 0,80.01 0,60.33 0,0 86.36,0 86.36,20.95 73.03,20.95 73.03,33.02 57.15,33.02 57.15,44.45 45.72,44.45 45.72,53.34 57.78,53.34 57.78,66.04 71.75,66.04 71.75,80.01
  pour Top (isolate 0.406, rank 2): 86.36,0 86.36,15.24 81.92,20 75.88,20 68.58,27.3 68.58,30.48 62.87,36.2 56.52,36.2 53.34,39.37 49.53,39.37 44.45,44.45 44.45,59.69 47.62,62.87 55.24,62.87 55.24,80.01 38.1,80.01 38.1,51.44 40.64,48.9 40.64,40.64 39.37,39.37 39.37,28.57 46.99,20.95 57.15,20.95 61.59,17.14 61.59,0
CLK  (via drill 1)
  Top 0.254: U$1.37 54.45,43.97 EXT_OSC.1
  Top 1.27: v84.45,44.45 SJ12.3
  Bottom 0.813: EXT_OSC.1 55.24,40.64 57.78,38.1 62.87,38.1 63.5,37.47 63.5,34.92 64.14,34.29 67.94,34.29 68.58,34.92 68.58,38.73 69.22,39.37 79.38,39.37 v84.45,44.45
CLKSEL
  Top 0.254: U$1.52 45.43,53.69 49.53,57.78 49.53,58.42
  Top 0.813: 49.53,58.42 50.16,59.05 SJ13.2
CS1
  Top 0.254: U$1.39 56.63,44.97 57.78,43.81 57.78,40.01 59.05,38.73 62.87,38.73 67.05,42.92
  Top 0.406: 67.05,42.92 IC4.24
GND  (via drill 1)
  Top 0.254: 79.15,44.45 IC4.3 80.72,44.52 81.28,45.09 81.28,45.72 80.88,46.12 IC4.5 | R17.1 R16.1 80.24,23.75 83.59,23.75 R15.1 | R15.1 83.5,23.98 | 64.77,74.93 JP2.13 | JP2.15 JP2.16 | 49.21,41.59 49.08,41.73 U$1.33 47.56,41.97 46.99,42.55 46.99,45.97 | GND_IN.MP 89.58,8.93 C18.- 93.81,8.93 C14.2 93.85,17.14 | IC3.1 93.85,17.39 93.85,17.14 | 46.93,49.53 46.93,45.97 46.99,45.97 | 46.93,49.53 46.93,50.8 U$1.49 | 46.99,45.97 U$1.41 | C10.- 64.86,66.76 65.41,67.31 65.41,67.5 C8.2 | 53.09,60.58 53.34,60.33 53.34,57.21 51.38,55.24 50.8,55.24 | U$1.51 45.93,50.53 46.93,49.53 | R15.1 91.59,23.98 93.34,22.23 93.34,17.65 93.85,17.14 | 71.75,45.4 70.72,45.4 IC4.21 | U$1.31 46.43,38.98 46.67,38.73 49.21,38.73
  Top 0.305: IC4.21 76.6,45.32 | 71.75,45.4 69.22,45.4 69.22,47.31 68.26,47.31
  Top 0.406: 77.47,44.45 79.15,44.45 | 46.93,50.8 51.38,55.24 | 64.77,78.11 64.77,76.83 65.41,76.83 JP2.16 66.99,78.42 | 72.39,76.83 72.39,78.11 | 72.39,74.3 72.39,75.56 73.03,76.2 | 73.03,76.2 76.83,76.2 | 72.39,76.83 73.03,76.2 | 72.39,76.83 71.75,76.83 JP2.20 | 69.85,74.3 69.85,78.11 69.22,78.74 67.31,78.74 66.99,78.42 | 67.31,74.3 67.31,78.11 66.99,78.42 | 49.21,38.73 49.21,41.59
  Top 0.61: 76.6,45.32 77.47,44.45
  Top 0.813: 64.86,74.84 64.77,74.93 | 64.86,67.94 65.17,67.63 | 53.09,60.58 SJ13.3
  Top 1.27: 64.77,74.93 JP2.15 | 64.86,67.94 64.86,74.84
  Bottom 0.254: JP1.10 JP1.8 JP1.6 JP1.4 | JP2.20 JP2.19 | JP2.16 67.94,79.38
  Bottom 0.406: 62.87,49.53 61.59,49.53 | 60.96,46.99 63.5,46.99 | 62.87,44.45 61.59,44.45
  Bottom 0.813: 67.94,79.38 69.22,79.38 JP2.20
  other vias: 65.41,46.99 45.72,46.99 85.72,59.69
  pour Top (isolate 0.406, rank 3): 100.33,80.01 38.73,80.01 38.73,0 100.33,0
  pour Bottom (isolate 0.406): 99.69,80.01 62.23,80.01 62.23,71.75 45.09,55.24 45.09,43.81 56.52,32.38 66.67,32.38 71.12,27.94 71.12,20.95 72.39,19.68 81.92,19.68 86.36,15.24 86.36,0 99.69,0
MISO
  Top 0.254: U$1.43 52.69,46.97
  Top 0.406: 59.05,52.7 58.42,52.7 52.69,46.97
  Top 0.61: 59.05,52.7 60.33,52.7 JP1.9 63.02,50.01 IC4.16
MOSI  (via drill 1)
  Top 0.254: 73.03,50.11 IC4.15 | U$1.34 50.88,42.47 52.07,41.27
  Top 0.406: 73.03,51.44 73.03,50.11
  Top 0.813: 73.03,51.44 72.39,52.07 v64.77,52.07 | 52.07,41.27 v52.07,40.64
  Bottom 0.254: 59.05,41.91 60.96,41.91 JP1.1 | 52.07,43.81 54.61,46.35 57.78,46.35
  Bottom 0.406: 59.05,41.91 57.78,43.18 57.78,46.35 57.78,52.07
  Bottom 0.813: 57.78,52.07 58.42,52.7 64.14,52.7 v64.77,52.07 | v52.07,40.64 52.07,43.81
N$1
  Top 0.254: U$1.28 44.93,39.05 47.94,36.04 50.8,36.04 52.25,34.58 C2.+
N$2
  Top 0.254: U$1.26 43.93,38.94 44.13,38.73 44.45,38.73 45.09,38.1 45.09,35.97 C4.+
N$3
  Top 0.254: 39.43,51.69 U$1.64 38.98,52.07 38.73,52.07
  Top 1.016: C7.2 36.7,52.07 38.73,52.07
N$4
  Top 0.254: U$1.30 45.93,38.84 46.67,38.1 48.98,38.1 C5.+
N$5
  Top 0.254: C6.1 49.53,63.5 | U$1.55 43.93,54.09
  Top 0.305: 49.53,65.81 C3.+
  Top 0.406: 43.93,54.09 46.35,56.52 46.35,57.15
  Top 1.27: C6.1 49.53,63.18 46.35,60.01 46.35,57.15 | 49.53,63.5 49.53,65.81
N$6
  Top 0.254: U$1.24 42.93,37.84 C12.1 43.5,36.83 45.09,35.24 45.09,33.34 48.94,33.34 49.85,32.38 C1.+
N$7
  Top 0.508: R9.1 arc-90 22.29,67.4 U$2.8
N$8
  Top 0.61: 40.64,41.91 40.64,46.99
N$9
  Top 0.254: U$1.10 31.86,44.97 arc-90 27.3,49.53 | R3.1 27.3,53.34 C25.2
  Top 0.508: 27.3,49.53 C25.2
N$11
  Top 0.254: 30.48,36.67 arc-90 U$1.13
  Top 0.406: 30.48,36.67 30.48,23.5 arc-90 25.4,18.41 15.24,18.41 arc90 11.43,15.24 R5.2
N$12
  Top 0.61: U$2.3 15.39,62.87 arc90 14.12,61.59 R2.2
N$13
  Top 0.61: R1.2 15.24,72.39 arc-90 15.88,71.75 15.88,68.58 arc-90 15.24,67.94 arc90 13.97,66.67 13.97,65.41 arc90 15.24,64.14 U$2.2
N$14
  Top 0.406: U$4.P$1 R1.1
N$15
  Top 0.406: U$5.P$1 R2.1
N$16
  Top 0.61: IC1.4 72.52,13.39 C13.1
N$17
  Top 0.406: U$6.P$1 R20.1
N$18
  Top 0.406: U$7.P$1 R21.1
N$19
  Top 0.508: U$2.1 arc90 18.9,67.22 R9.2
N$20
  Top 0.254: C25.1 27.3,58.42
  Top 0.406: U$2.6 24.77,62.87 arc-90 27.3,60.33
  Top 0.508: 27.3,60.33 C25.1
N$21  (via drill 1)
  Top 0.406: R19.1 22.23,10.16 v22.86,9.53
  Bottom 0.406: v22.86,9.53 22.86,8.79 U$10.P$2
N$22  (via drill 1)
  Top 0.406: R18.1 13.97,8.89 v12.7,7.62
  Bottom 0.406: v12.7,7.62 11.53,7.62 U$11.P$2
N$23
  Top 0.406: R5.1 11.43,10.79 U$11.P$1
N$24
  Top 0.254: U$1.14 37.26,42.97 arc90 33.66,39.37
  Top 0.406: R10.2 arc-90 22.07,16.51 26.04,16.51 arc90 33.66,25.4 33.66,39.37
N$25
  Top 0.508: U$3.1 arc90 18.9,34.83 R8.2
N$26
  Top 0.406: U$3.6 24.77,30.48 arc90 27.3,33.02
  Top 0.508: 27.3,33.02 C24.1
N$27
  Top 0.406: U$10.P$1 R10.1
N$28
  Top 0.61: R20.2 15.24,40.01 arc-90 15.88,39.37 15.88,36.2 arc-90 15.24,35.56 arc90 13.97,34.29 13.97,33.02 arc90 15.24,31.75 U$3.2
N$29
  Top 0.406: U$3.3 15.24,30.48 arc90 14.12,29.36 R21.2
N$30  (via drill 1)
  Top 0.406: R7.1 10.16,53.98 v9.53,53.34
  Bottom 0.406: v9.53,53.34 8.79,53.34 U$5.P$2
N$31  (via drill 1)
  Top 0.406: R6.1 10,69.85 v9.37,69.22
  Bottom 0.406: v9.37,69.22 9.11,69.22 U$4.P$2
N$32
  Top 0.254: C24.2 27.79,37.44 | U$1.12 31.91,43.97 arc90 27.3,39.37
  Top 0.406: 27.3,39.37 R4.1
  Top 0.508: C24.2 27.3,39.37
N$33
  Top 0.508: U$3.8 22.29,35.02 arc90 R8.1
N$34
  Top 0.254: U$1.61 40.93,55.38
  Top 0.305: 40.93,55.38 R13.2
  Top 1.016: R13.2 42.67,57.13 C17.2
N$35
  Top 0.813: Q1.2 88.97,40.89 C20.2 87.63,42.23 86.68,42.23 86.04,42.86 86.04,48.9 85.79,49.15 SJ12.1
N$36
  Top 0.254: 36.16,41.83 arc-90 36.79,42.46 arc-5 U$1.15
  Top 0.406: R24.2 36.16,41.83
N$37
  Top 0.254: U$1.16 arc-90 38.1,41.15 38.1,34.29
  Top 0.406: 38.1,34.29 arc53 39.37,31.75 50.8,20.32 arc-46 52.07,17.14 arc3 R25.2
N$38
  Top 0.254: C19.2 87.7,50.55
  Top 0.406: IC4.8 81.18,50.48
  Top 0.813: 87.7,50.55 Q1.1 | 81.18,50.48 81.63,50.93 C19.2
N$39
  Top 0.254: 38.42,46.04 38.42,42.23 arc-90 38.73,41.91 38.73,39.05 arc53 39.05,38.42 arc-53 39.37,37.78 39.37,34.29 arc53 40.64,31.75 50.8,21.91 arc-35 54.61,14.61
N$40
  Top 0.406: 84.36,47.72 SJ12.2
  Top 0.61: IC4.7 84.36,47.72
N$41
  Top 0.406: IC4.32 77.73,36.45 76.2,34.92
  Top 0.61: LED3.A 76.2,34.92
N$42
  Top 0.406: 79.38,41.91 79.22,42.06 IC4.1
  Top 0.813: LED2.A 79.38,34.13 79.38,41.91
N$43
  Top 0.61: IC4.2 80.11,43.72 80.64,43.18 80.64,37.15 83.5,34.29 83.5,33.82 LED1.A
N$44
  Top 1.676: R15.2 LED1.C
N$45
  Top 1.676: R16.2 LED2.C
N$46
  Top 1.676: R17.2 LED3.C
N$47
  Top 0.406: U$9.P$1 R24.1
N$48
  Top 0.254: 37.15,34.29 37.15,17.78 arc90 38.73,16.19 arc-90 40.64,14.29 | 37.15,34.29 37.15,41.43 | 37.15,34.29 arc49 38.73,30.8 49.21,20.32 arc-44 50.16,18.1 50.16,12.7 | 34.21,42.11 33.75,41.78 arc47 32.35,39.01 32.35,24.41 arc-90 25.4,17.46 21.59,17.46 arc90 16.83,12.7 | R22.2 14.61,36.98 | 19.05,62.23 15.88,62.23 arc90 15.24,61.59 | 19.05,63.5 12.7,63.5 | 19.05,64.77 15.88,64.77 arc-90 15.24,65.41 | 12.7,71.12 5.71,71.12 | 12.7,55.24 5.71,55.24 | 12.7,38.73 5.71,38.73 | 5.71,22.86 12.7,22.86 | 19.68,29.84 15.88,29.84 arc90 15.24,29.21 | 12.7,31.11 19.68,31.11 24.13,31.11 arc90 25.4,32.38 | 20.32,63.5 26.04,63.5 | 26.04,63.5 arc-90 29.21,60.33 | 29.21,49.53 arc90 33.27,45.47 U$1.9 | 15.24,33.02 arc90 15.88,32.38 19.68,32.38 | 26.04,63.5 28.57,63.5 | R19.2 22.71,14.61 | 20.95,12.7 20.95,5.71 | 12.7,12.7 12.7,10.79 arc-53 11.43,8.26 | 37.47,12.7 37.47,5.71 | 53.34,12.7 53.34,5.71 | 29.21,33.66 29.21,39.37 arc-90 33.02,43.5 34.44,43.5 | U$1.11 27.96,44.47 27.94,44.45
  Top 0.356: 40.02,63.5 IC2.3 | 40.02,63.5 IC2.4 | 38.1,63.5 40.02,63.5
  Top 0.406: 12.7,21.59 R23.2 | 12.7,21.59 12.7,22.86 12.7,26.04 | 12.7,26.04 12.7,31.11 12.7,34.92 | 12.7,34.92 12.7,37.47 | 12.7,37.47 R22.2 | 12.7,51.44 15.24,51.44 arc90 16.51,52.7 16.51,57.78 arc90 15.88,58.42 arc-90 15.24,59.05 15.24,61.59 | 13.97,53.98 R7.2 12.7,53.98 | 12.7,69.85 R6.2 | 12.7,53.98 12.7,55.24 12.7,58.42 | 12.7,58.42 12.7,63.5 12.7,67.31 | 12.7,67.31 12.7,69.85 | 12.7,53.98 12.7,51.44 | 19.05,63.5 19.05,62.23 | 19.05,63.5 19.05,64.77 | 12.7,74.3 12.7,71.12 12.7,69.85 | 12.7,74.3 6.99,74.3 arc90 5.71,73.03 5.71,71.12 5.71,69.22 arc90 7.62,67.31 12.7,67.31 | 12.7,51.44 6.99,51.44 arc-90 5.71,53.34 5.71,55.24 5.71,57.15 arc-90 6.99,58.42 12.7,58.42 | 19.05,63.5 20.32,63.5 20.32,61.59 U$2.5 24.13,61.59 | 29.21,60.33 29.21,49.53 | U$3.5 22.23,29.21 19.68,29.21 19.68,29.84 19.68,31.11 19.68,32.38 | 12.7,41.91 15.88,41.91 arc-90 17.14,40.64 17.14,35.56 arc-90 16.51,34.92 arc90 15.24,33.66 15.24,33.02 | 12.7,41.91 12.7,38.73 12.7,37.47 | 12.7,41.91 6.99,41.91 arc90 5.71,40.64 5.71,38.73 5.71,36.83 arc90 7.62,34.92 12.7,34.92 | 12.7,26.04 6.99,26.04 arc90 5.71,24.77 5.71,22.86 5.71,20.95 arc90 7.62,19.05 9.53,19.05 | 9.53,19.05 12.7,19.05 12.7,19.68 | 12.7,19.68 12.7,21.59 | 12.7,74.3 15.24,74.3 arc-90 17.14,72.39 17.14,67.94 arc-90 16.51,67.31 arc90 15.24,66.04 15.24,65.41 | 30.48,65.41 arc-90 31.11,66.04 | 15.24,29.21 15.24,26.67 arc90 15.88,26.04 arc-90 16.51,25.4 16.51,20.32 arc-90 15.88,19.68 12.7,19.68 | 13.97,12.7 R18.2 | 15.88,12.7 13.97,12.7 | 15.88,12.7 16.83,12.7 17.78,12.7 | 17.78,12.7 20.95,12.7 22.23,12.7 | 22.23,12.7 R19.2 | 24.77,12.7 24.77,8.26 arc-90 22.23,5.71 20.95,5.71 19.68,5.71 arc-90 17.78,7.62 17.78,12.7
  Top 0.406: 22.23,12.7 24.77,12.7 | 15.88,12.7 15.88,10.16 arc-53 14.61,6.99 12.7,5.08 arc-53 9.53,3.81 6.99,3.81 arc-90 5.71,5.08 5.71,5.71 arc-10 5.71,6.35 | 5.71,6.35 arc-44 6.99,8.89 8.89,10.79 arc53 9.53,12.7 | 9.53,12.7 12.7,12.7 13.97,12.7 | 11.43,8.26 10.16,6.99 arc-37 8.89,6.35 5.71,6.35 | 54.61,12.7 R27.2 | 38.73,12.7 40.64,12.7 | 40.64,12.7 41.27,12.7 | 41.27,12.7 50.16,12.7 | 50.16,12.7 53.34,12.7 54.61,12.7 | 38.73,12.7 R26.2 | 54.61,12.7 57.15,12.7 57.15,8.26 arc-90 54.61,5.71 53.34,5.71 52.07,5.71 arc-90 50.16,7.62 50.16,12.7 | 41.27,12.7 41.27,8.26 arc-90 38.73,5.71 37.47,5.71 36.2,5.71 arc-90 34.29,7.62 34.29,12.7 | 34.29,12.7 37.47,12.7 38.73,12.7 | 9.53,12.7 9.53,19.05 | 24.77,12.7 34.29,12.7 | 40.64,12.7 40.64,14.29
  Top 0.508: 24.13,61.59 arc-90 25.4,60.33 25.4,49.53 arc46 27.3,45.09 arc-3 27.94,44.45 arc53 25.4,39.37 25.4,32.38 | 22.23,29.21 24.77,29.21 arc90 29.21,33.66
  Top 0.559: 31.11,66.04 36.83,66.04 37.47,65.41 37.47,64.14 38.1,63.5 | 28.57,63.5 arc90 30.48,65.41
N$49
  Top 0.406: U$8.P$1 R25.1
N$58  (via drill 1)
  Top 0.406: v9.53,21.59 R23.1
  Bottom 0.406: v9.53,21.59 8.16,21.59 U$7.P$2
N$59  (via drill 1)
  Top 0.406: R22.1 10.16,37.47 v9.53,36.83
  Bottom 0.406: v9.53,36.83 8.79,36.83 U$6.P$2
N$65  (via drill 1)
  Top 0.406: R27.1 54.61,10.16 v55.24,9.53
  Bottom 0.406: v55.24,9.53 55.24,8.79 U$8.P$2
N$66  (via drill 1)
  Top 0.406: R26.1 38.73,9.53 v39.37,8.89
  Bottom 0.406: v39.37,8.89 39.37,8.79 U$9.P$2
PD0
  Top 0.254: 76.2,41.36 IC4.30
  Top 0.406: 73.98,25.72 89.22,25.72 | 73.03,34.29 76.2,37.47 76.2,41.36
  Top 0.61: 89.22,25.72 97.79,34.29 97.79,60.01 78.42,79.38
  Top 0.813: JP2.22 75.56,79.38 78.42,79.38
  Top 1.016: 73.98,25.72 73.03,26.67 73.03,34.29
PD1
  Top 0.406: IC4.31 76.93,36.92 74.3,34.29 74.3,32.38 | 74.93,31.75 92.08,31.75
  Top 0.61: 74.93,31.75 74.3,32.38 | 92.08,31.75 96.52,36.2 96.52,58.42
  Top 0.813: JP2.24 77.47,77.47 81.6,73.34 96.52,58.42
PD6
  Top 0.406: IC4.10 76.93,74.2
  Top 1.016: 76.93,74.2 76.83,74.3 | 76.83,74.3 76.83,52.7 | 76.83,74.3 JP2.23
PD7
  Top 0.406: IC4.11 76.13,51.19 75.25,52.07
  Top 1.016: 75.25,52.07 75.25,73.34 JP2.21
REF_NODE
  Top 0.305: 35.56,62.65 IC2.1
  Top 0.406: C22.1 35.56,61.09 R12.2
  Top 0.813: R11.1 35.56,62.65 R12.2
RLD_OUT
  Top 0.254: U$1.62 U$1.63 39.93,52.78
  Top 0.305: 39.93,52.78 38.73,53.98 38.73,55.73 R13.1
  Top 0.813: RLD_OUT.1 44.45,63.18 39.88,58.61
  Top 1.016: R13.1 38.58,57.13 C17.1 39.88,58.61
SCLK
  Top 0.254: U$1.40 55.63,45.47
  Top 0.305: 55.63,45.47 55.88,45.72
  Top 0.406: 55.88,45.72 58.42,48.26 58.42,48.9 59.05,49.53 60.96,49.53
  Top 0.61: IC4.17 62.49,48.52 JP1.7 60.96,49.53
START
  Top 0.254: U$1.38 55.86,44.47 57.15,43.18 57.15,39.37 58.42,38.1 63.5,38.1 66.67,41.27 71.98,41.27 IC4.25
UCRESET  (via drill 1)
  Top 0.254: 68.73,38.1 R14.1 69.7,38.1
  Top 0.508: 75.33,39.13 IC4.29
  Top 0.61: 75.33,39.13 74.3,38.1 69.7,38.1 | 68.73,38.1 67.94,38.1 v66.67,36.83
  Bottom 0.813: JP1.5 63.5,45.72 66.67,42.55 v66.67,36.83
VCC_IN
  Top 0.254: VCC_IN.MP 96.65,3.94
  Top 0.61: 78.28,7.39 IC1.8 77.47,5.71 | 73.66,5.71 IC1.5
  Top 0.813: 77.47,5.71 76.83,5.08 74.3,5.08 73.66,5.71
  Top 1.016: 78.28,7.39 C15.+
  Top 1.27: C15.+ 80.01,3.17 | IC3.3 99.06,21.98 99.06,8.89 C14.1
  Top 1.676: 96.65,3.94 C14.1 | 80.01,3.17 81.92,1.27 93.98,1.27 VCC_IN.MP
VDD
  Top 0: U$1.59 41.91,51.6
  Top 0.254: 76.83,13.65 76.46,13.65 IC1.2 | 41.93,52.7 U$1.59 | 41.93,52.7 43.43,52.7 U$1.56 43.43,50.55 43.81,50.16 44.43,50.16 U$1.54 | U$1.7 U$1.8 | 38.1,68.08 C16.1 38.72,67.19 38.72,66.04 | U$1.19 40.43,39.58 | 41.91,51.6 41.91,50.8 | 41.91,47.62 41.91,47.47 | 40.43,47.47 U$1.19 | 38.72,66.04 IC2.5 | 41.93,52.7 41.93,53.99 45.09,57.15 45.09,60.96 46.99,62.87 46.99,67.31 45.72,68.58 43.18,68.58 42.55,67.94 42.55,66.67 41.91,66.04 38.72,66.04 | U$1.19 40.43,38.73 | 40.43,38.73 41.59,38.73 41.59,39.82 U$1.21 U$1.22 | 40.43,38.73 40.43,37.38 C11.+ 41.91,36.11 41.91,33.02 43.81,31.11 C9.1 48.61,27.46 C23.+ 60.06,16.96 66.89,16.96
  Top 0.406: U$1.1 U$1.2 U$1.3 U$1.4 U$1.5 U$1.6 U$1.7 | 56.52,79.38 JP2.10 JP2.12 | C16.1 36.04,67.94 R11.2 | U$3.7 23.5,31.75 | 24.77,64.77 24.77,64.14 | 15.88,48.26 arc-90 21.59,42.55 21.59,38.73 arc90 22.86,37.47 arc-90 24.13,36.2 24.13,32.38
  Top 0.61: IC1.2 IC1.1 | R11.2 31.27,67.46 arc69 29.21,66.04 arc-90 27.3,64.14 24.77,64.14 U$2.7 | 23.5,31.75 arc90 24.13,32.38 | 15.88,48.26 8.89,48.26 arc-90 4.45,52.7 4.45,57.15 arc-90 6.99,59.69 10.16,59.69 arc90 11.43,60.96 11.43,64.77 arc90 10.16,66.04 6.99,66.04 arc-90 4.45,69.22 4.45,73.03 arc-90 6.99,75.56 15.24,75.56 arc-90 18.41,72.39 18.41,71.12 arc90 19.68,69.85 22.86,69.85 arc-90 24.77,67.94 24.77,64.77 | 41.91,47.47 40.43,47.47 U$1.5 | 41.91,50.8 41.91,47.62
  Top 0.813: 56.52,79.38 40.01,79.38 38.1,77.47 38.1,68.08
  Top 1.27: 76.83,13.65 76.83,15.24 75.12,16.96 C13.2 66.89,16.96

### Text on the board
Top: (c) 2011 by Sebastian Götte
Bottom: (c) 2011 by Sebastian Götte